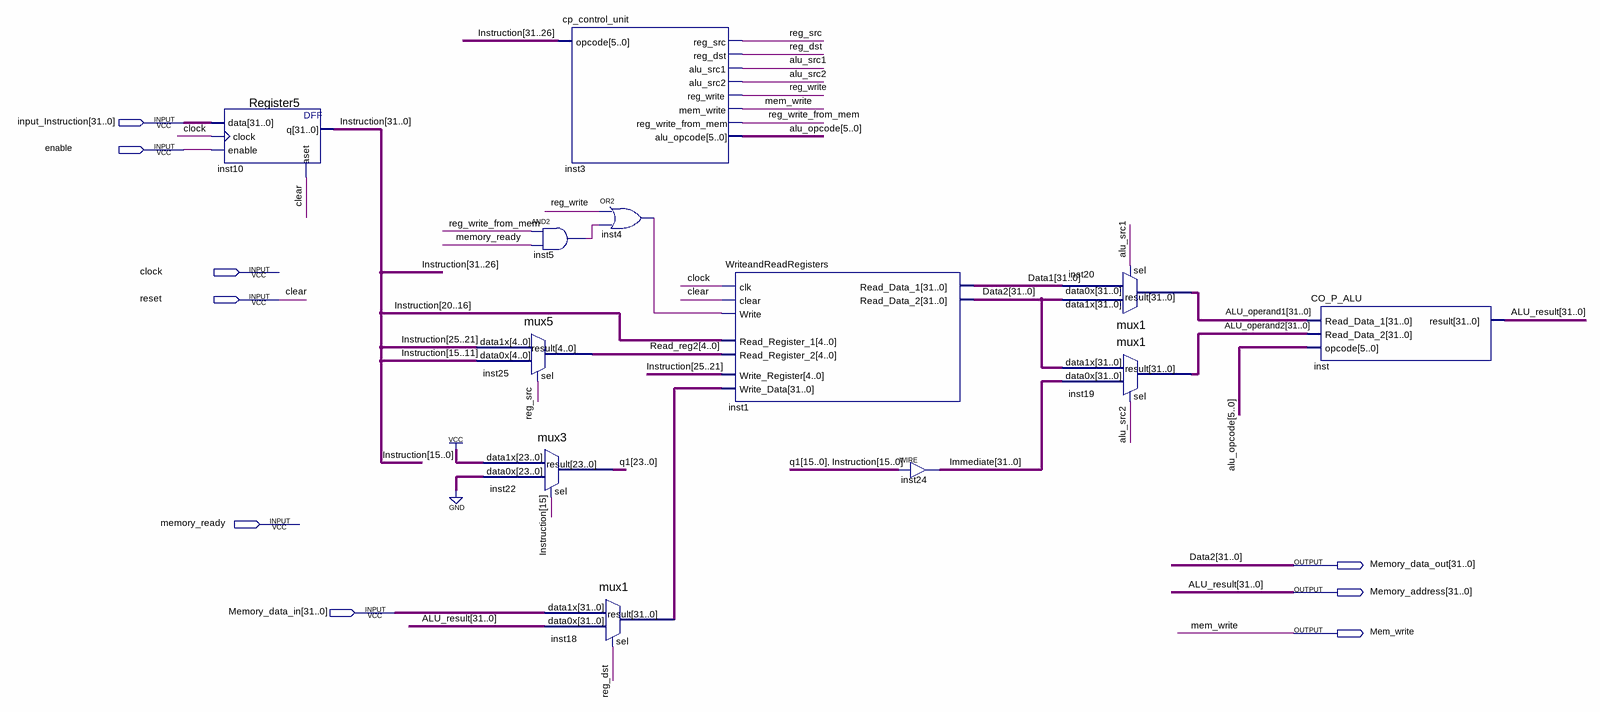
[diagram p0: schematic sheet]
// Quartus schematic Coprocessor.bdf as structural Verilog: 12 symbols, 9 pins
module Coprocessor (
  input  [31:0] input_Instruction,
  input  enable,
  input  clock,
  input  reset,
  input  memory_ready,
  input  [31:0] Memory_data_in,
  output [31:0] Memory_data_out,
  output [31:0] Memory_address,
  output Mem_write
);

  wire alu_src1, alu_src2, inst4_out, inst5_out, reg_dst, reg_src, reg_write, reg_write_from_mem;
  wire [4:0] Read_reg2;
  wire [5:0] alu_opcode;
  wire [23:0] q1;
  wire [31:0] ALU_operand1, ALU_operand2, Data1, Immediate, inst18_result, Instruction;

  Register5 inst10 (.data(input_Instruction), .clock(clock), .enable(enable), .aset(reset), .q(Instruction));
  mux5 inst25 (.data1x(Instruction[25:21]), .data0x(Instruction[15:11]), .sel(reg_src), .result(Read_reg2));
  mux3 inst22 (.data1x({24{1'b1}}), .data0x({24{1'b0}}), .sel(Instruction[15]), .result(q1));
  cp_control_unit inst3 (
    .opcode(Instruction[31:26]), .reg_src(reg_src), .reg_dst(reg_dst), .alu_src1(alu_src1),
    .alu_src2(alu_src2), .reg_write(reg_write), .mem_write(Mem_write),
    .reg_write_from_mem(reg_write_from_mem), .alu_opcode(alu_opcode));
  and inst5 (inst5_out, reg_write_from_mem, memory_ready);
  mux1 inst18 (.data1x(Memory_data_in), .data0x(Memory_address), .sel(reg_dst), .result(inst18_result));
  or inst4 (inst4_out, reg_write, inst5_out);
  WriteandReadRegisters inst1 (
    .Write_Data(inst18_result), .clk(clock), .clear(reset), .Write(inst4_out),
    .Write_Register(Instruction[25:21]), .Read_Register_1(Instruction[20:16]), .Read_Register_2(Read_reg2),
    .Read_Data_1(Data1), .Read_Data_2(Memory_data_out));
  assign Immediate = {q1[15:0], Instruction[15:0]};  // WIRE inst24
  mux1 inst20 (.data1x(Memory_data_out), .data0x(Data1), .sel(alu_src1), .result(ALU_operand1));
  mux1 inst19 (.data1x(Memory_data_out), .data0x(Immediate), .sel(alu_src2), .result(ALU_operand2));
  CO_P_ALU inst (.Read_Data_1(ALU_operand1), .Read_Data_2(ALU_operand2), .opcode(alu_opcode), .result(Memory_address));

  // Other names for the same wires on the sheet: ALU_result[31:0] = Memory_address; clear = reset;
  //   Data2[31:0] = Memory_data_out
endmodule
